# EAGLE board I2CHubLogicLevel (EAGLE 8.4.0)
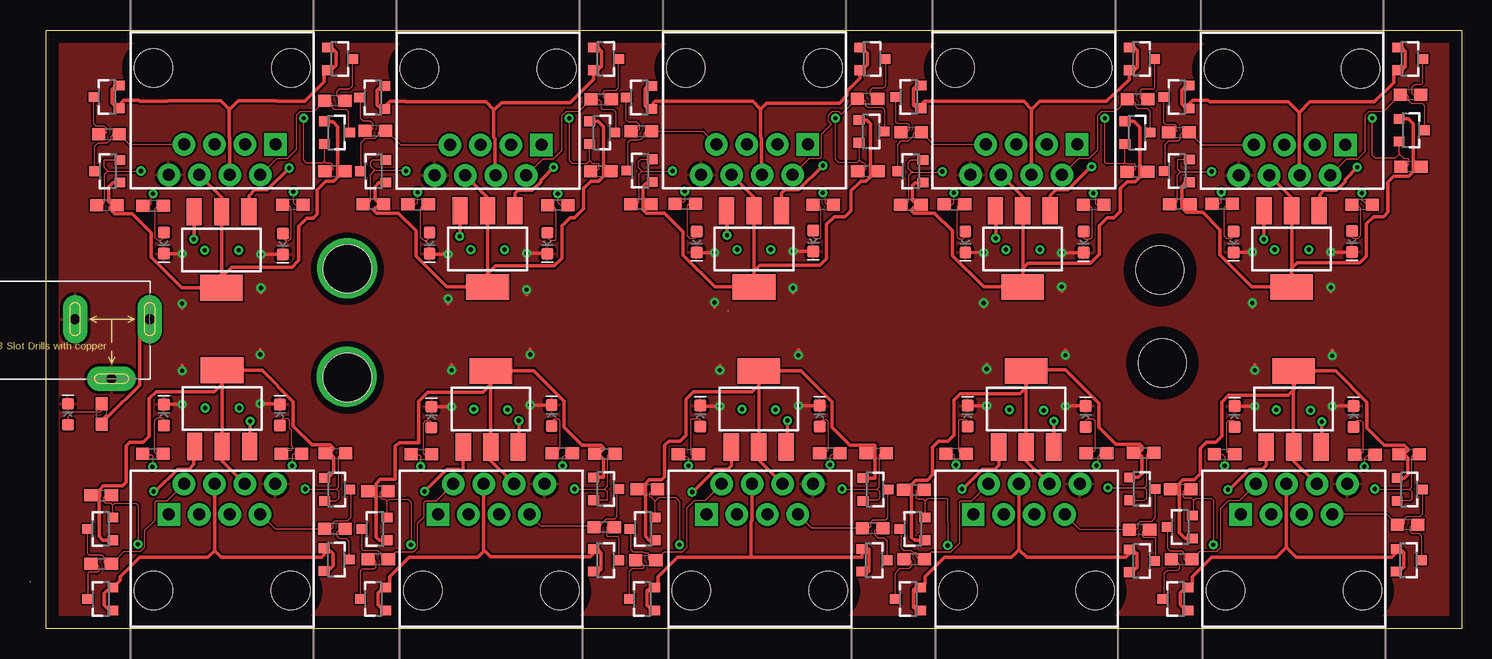
[diagram p2: board, top side]
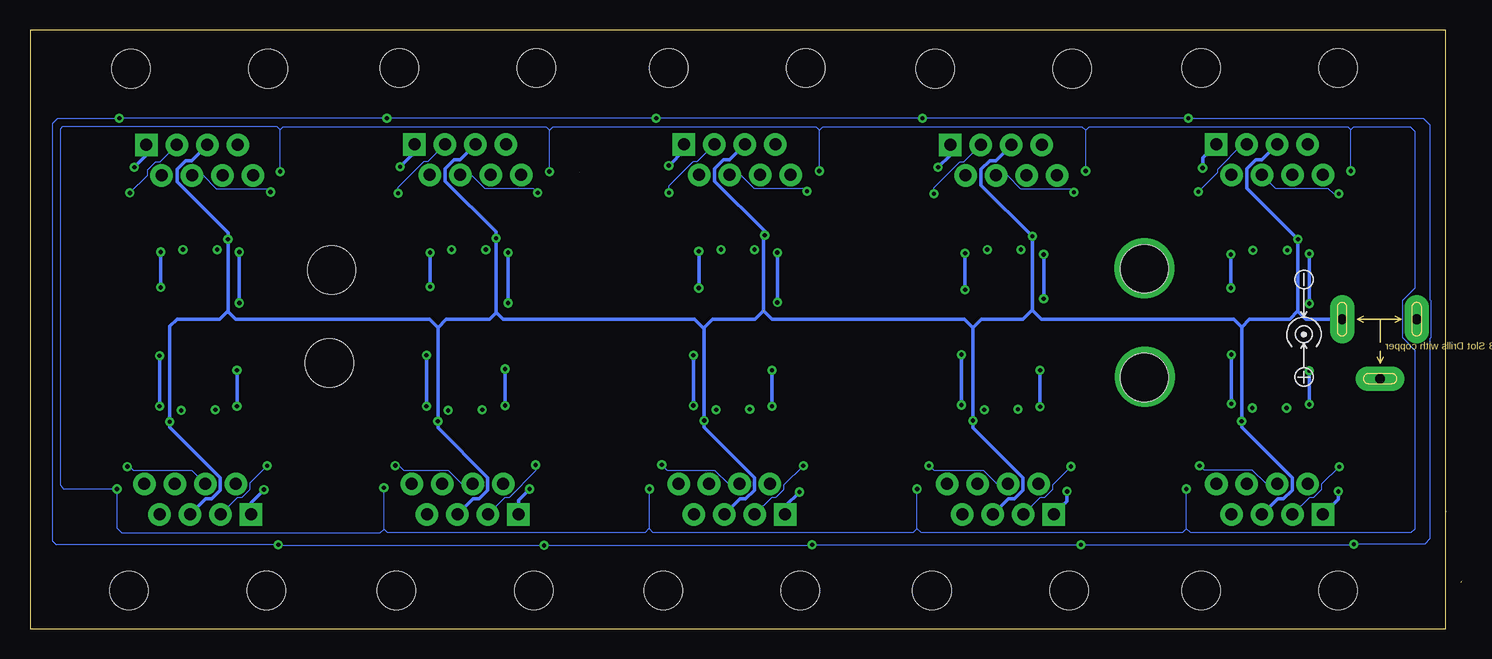
[diagram p3: board, bottom side, seen from below]

Size 119.35 x 49.9 mm. Coordinates in mm from the lower left corner, seen from the top.
Outline: 1.35,9.75 1.35,0 119.35,0 119.35,49.9 1.35,49.9 1.35,9.75
Outline: 1.3,9.75 1.35,9.75
Outline: 0.05,3.9 0,3.95
Copper layers (1*16): Top 0.035mm / dielectric 1.5mm / Bottom 0.035mm
Design rules "default": minimum track width 6mil, minimum drill 0.35mm, track to track 6mil, track to pad 6mil, pad to pad 6mil, via to via 6mil, smd to smd 6mil, copper to edge 40mil, drill to drill 6mil, minimum pad ring 10mil, minimum via ring 8mil, stop-mask expansion 4mil, vias tented up to drill 0mil, thermal gap 10mil
Holes 4 mm at 26.45,30 26.45,20.95 94.2,29.9 94.4,22.15

## Footprints (pad centres in the part's own frame; a part is rotated, then mirrored left to right if it is on the bottom)
LED-0603 = smd 1 x 1: A -0.877,0; C 0.877,0
0603 = smd 1.1 x 1: 1 -0.85,0; 2 0.85,0
SOT-223 = smd 1.27 x 2.286: 1 -2.286,-3.175; 2 0,-3.175; 3 2.286,-3.175 | smd 3.556 x 2.159: TER 0,3.175
DCJ3P-14.2X11.0X9.0MM = drill 0.813 pad 2.032 long: + 3.175,0; -1 -3.048,0; -2 0,-4.953
RJ45-8 = drill 1 pad 1.88 square: 1 -4.445,6.35 | drill 1 pad 1.88: 2 -3.175,8.89; 3 -1.905,6.35; 4 -0.635,8.89; 5 0.635,6.35; 6 1.905,8.89; 7 3.175,6.35; 8 4.445,8.89 | hole 3.2: -5.715,0; 5.715,0
SOT23-3 = smd 0.8 x 0.9: 1 -0.95,-1; 2 0.95,-1; 3 0,1.1

## Placement (x,y rotation side)
3.3VLED0  Yellow  [LED-0603]  11.15,17.83 90 top
3.3VLED1  Yellow  [LED-0603]  33.47,17.63 90 top
3.3VLED2  Yellow  [LED-0603]  55.89,17.73 90 top
3.3VLED3  Yellow  [LED-0603]  78.16,17.73 90 top
3.3VLED4  Yellow  [LED-0603]  100.43,17.68 90 top
3.3VLED5  Yellow  [LED-0603]  110.2,32.28 270 top
3.3VLED6  Yellow  [LED-0603]  87.82,32.23 270 top
3.3VLED7  Yellow  [LED-0603]  65.29,32.33 270 top
3.3VLED8  Yellow  [LED-0603]  43.11,32.13 270 top
3.3VLED9  Yellow  [LED-0603]  21.08,32.08 270 top
3.3VLEDR0  68OHM-0603-1/10W-1%  [0603]  10.25,14.58 0 top
3.3VLEDR1  68OHM-0603-1/10W-1%  [0603]  32.62,14.53 0 top
3.3VLEDR2  68OHM-0603-1/10W-1%  [0603]  54.89,14.53 0 top
3.3VLEDR3  68OHM-0603-1/10W-1%  [0603]  77.2,14.6 0 top
3.3VLEDR4  68OHM-0603-1/10W-1%  [0603]  99.57,14.55 0 top
3.3VLEDR5  68OHM-0603-1/10W-1%  [0603]  111.04,35.35 180 top
3.3VLEDR6  68OHM-0603-1/10W-1%  [0603]  88.66,35.35 180 top
3.3VLEDR7  68OHM-0603-1/10W-1%  [0603]  66.13,35.35 180 top
3.3VLEDR8  68OHM-0603-1/10W-1%  [0603]  44,35.3 180 top
3.3VLEDR9  68OHM-0603-1/10W-1%  [0603]  21.92,35.35 180 top
3.3VREG0  CJT1117-3.3-SOT223  [SOT-223]  16.02,18.36 0 top
3.3VREG1  CJT1117-3.3-SOT223  [SOT-223]  38.41,18.31 0 top
3.3VREG2  CJT1117-3.3-SOT223  [SOT-223]  60.75,18.31 0 top
3.3VREG3  CJT1117-3.3-SOT223  [SOT-223]  83.04,18.31 0 top
3.3VREG4  CJT1117-3.3-SOT223  [SOT-223]  105.33,18.31 0 top
3.3VREG5  CJT1117-3.3-SOT223  [SOT-223]  105.17,31.66 180 top
3.3VREG6  CJT1117-3.3-SOT223  [SOT-223]  82.76,31.66 180 top
3.3VREG7  CJT1117-3.3-SOT223  [SOT-223]  60.35,31.66 180 top
3.3VREG8  CJT1117-3.3-SOT223  [SOT-223]  38.14,31.66 180 top
3.3VREG9  CJT1117-3.3-SOT223  [SOT-223]  15.97,31.58 180 top
5VLED0  RED  [LED-0603]  20.84,17.83 90 top
5VLED1  RED  [LED-0603]  43.48,17.78 90 top
5VLED2  RED  [LED-0603]  65.82,17.73 90 top
5VLED3  RED  [LED-0603]  88.01,17.69 90 top
5VLED4  RED  [LED-0603]  110.35,17.69 90 top
5VLED5  RED  [LED-0603]  100.34,32.24 270 top
5VLED6  RED  [LED-0603]  77.98,32.24 270 top
5VLED7  RED  [LED-0603]  55.57,32.24 270 top
5VLED8  RED  [LED-0603]  33.31,32.14 270 top
5VLED9  RED  [LED-0603]  11.15,32.14 270 top
5VLEDR0  150  [0603]  21.8,14.6 180 top
5VLEDR1  150  [0603]  44.36,14.61 180 top
5VLEDR2  150  [0603]  66.68,14.61 180 top
5VLEDR3  150  [0603]  88.9,14.61 180 top
5VLEDR4  150  [0603]  111.27,14.51 180 top
5VLEDR5  150  [0603]  99.39,35.41 0 top
5VLEDR6  150  [0603]  77.06,35.36 0 top
5VLEDR7  150  [0603]  54.63,35.41 0 top
5VLEDR8  150  [0603]  32.35,35.36 0 top
5VLEDR9  150  [0603]  10.27,35.26 0 top
EXTERNALPOWER  DC-005  [DCJ3P-14.2X11.0X9.0MM]  6.8,25.8 0 top
INOUT0  RJ45  [RJ45-8]  16.01,3.18 0 top
INOUT1  RJ45  [RJ45-8]  38.45,3.18 0 top
INOUT2  RJ45  [RJ45-8]  60.84,3.18 0 top
INOUT3  RJ45  [RJ45-8]  83.08,3.18 0 top
INOUT4  RJ45  [RJ45-8]  105.37,3.18 0 top
INOUT5  RJ45  [RJ45-8]  105.21,46.67 180 top
INOUT6  RJ45  [RJ45-8]  82.85,46.72 180 top
INOUT7  RJ45  [RJ45-8]  60.39,46.72 180 top
INOUT8  RJ45  [RJ45-8]  38.18,46.67 180 top
INOUT9  RJ45  [RJ45-8]  16.02,46.72 180 top
MAINLED  GREEN  [LED-0603]  3.15,17.88 90 top
MAINLEDR  150  [0603]  5.98,17.9 90 top
SC0HVR  10k  [0603]  25.42,8.32 180 top
SC0HVT  220mA/50V/3.5Ω  [SOT23-3]  25.53,5.76 270 top
SC0LVR  10k  [0603]  25.47,14.62 0 top
SC0LVT  220mA/50V/3.5Ω  [SOT23-3]  25.55,11.61 270 top
SC1HVR  10k  [0603]  47.86,8.47 180 top
SC1HVT  220mA/50V/3.5Ω  [SOT23-3]  47.97,5.71 270 top
SC1LVR  10k  [0603]  47.91,14.57 0 top
SC1LVT  220mA/50V/3.5Ω  [SOT23-3]  47.99,11.66 270 top
SC2HVR  10k  [0603]  70.25,8.37 180 top
SC2HVT  220mA/50V/3.5Ω  [SOT23-3]  70.36,5.71 270 top
SC2LVR  10k  [0603]  70.55,14.62 0 top
SC2LVT  220mA/50V/3.5Ω  [SOT23-3]  70.43,11.61 270 top
SC3HVR  10k  [0603]  92.49,8.27 180 top
SC3HVT  220mA/50V/3.5Ω  [SOT23-3]  92.65,5.66 270 top
SC3LVR  10k  [0603]  92.84,14.67 0 top
SC3LVT  220mA/50V/3.5Ω  [SOT23-3]  92.67,11.66 270 top
SC4HVR  10k  [0603]  114.83,8.67 180 top
SC4HVT  220mA/50V/3.5Ω  [SOT23-3]  114.89,5.71 270 top
SC4LVR  10k  [0603]  114.96,14.53 0 top
SC4LVT  220mA/50V/3.5Ω  [SOT23-3]  114.96,11.61 270 top
SC5HVR  10k  [0603]  95.77,41.37 0 top
SC5HVT  220mA/50V/3.5Ω  [SOT23-3]  95.63,44.31 90 top
SC5LVR  10k  [0603]  95.85,35.38 180 top
SC5LVT  220mA/50V/3.5Ω  [SOT23-3]  95.65,38.16 90 top
SC6HVR  10k  [0603]  73.46,41.37 0 top
SC6HVT  220mA/50V/3.5Ω  [SOT23-3]  73.26,44.33 90 top
SC6LVR  10k  [0603]  73.44,35.33 180 top
SC6LVT  220mA/50V/3.5Ω  [SOT23-3]  73.43,38.13 90 top
SC7HVR  10k  [0603]  50.95,41.47 0 top
SC7HVT  220mA/50V/3.5Ω  [SOT23-3]  50.8,44.28 90 top
SC7LVR  10k  [0603]  50.93,35.38 180 top
SC7LVT  220mA/50V/3.5Ω  [SOT23-3]  50.87,38.18 90 top
SC8HVR  10k  [0603]  28.79,41.52 0 top
SC8HVT  220mA/50V/3.5Ω  [SOT23-3]  28.59,44.28 90 top
SC8LVR  10k  [0603]  28.62,35.38 180 top
SC8LVT  220mA/50V/3.5Ω  [SOT23-3]  28.66,38.13 90 top
SC9HVR  10k  [0603]  6.58,41.22 0 top
SC9HVT  220mA/50V/3.5Ω  [SOT23-3]  6.43,44.33 90 top
SC9LVR  10k  [0603]  6.41,35.28 180 top
SC9LVT  220mA/50V/3.5Ω  [SOT23-3]  6.5,38.13 90 top
SD0HVR  10k  [0603]  5.94,5.41 0 top
SD0HVT  220mA/50V/3.5Ω  [SOT23-3]  5.92,2.48 90 top
SD0LVR  10k  [0603]  5.94,11.11 0 top
SD0LVT  220mA/50V/3.5Ω  [SOT23-3]  5.91,8.33 90 top
SD1HVR  10k  [0603]  29.03,5.81 0 top
SD1HVT  220mA/50V/3.5Ω  [SOT23-3]  28.64,2.48 90 top
SD1LVR  10k  [0603]  29.01,11.47 0 top
SD1LVT  220mA/50V/3.5Ω  [SOT23-3]  28.78,8.33 90 top
SD2HVR  10k  [0603]  51.32,5.71 0 top
SD2HVT  220mA/50V/3.5Ω  [SOT23-3]  51.05,2.48 90 top
SD2LVR  10k  [0603]  51.45,11.62 0 top
SD2LVT  220mA/50V/3.5Ω  [SOT23-3]  51.12,8.33 90 top
SD3HVR  10k  [0603]  73.71,5.81 0 top
SD3HVT  220mA/50V/3.5Ω  [SOT23-3]  73.24,2.48 90 top
SD3LVR  10k  [0603]  73.69,11.57 0 top
SD3LVT  220mA/50V/3.5Ω  [SOT23-3]  73.61,8.33 90 top
SD4HVR  10k  [0603]  96,5.81 0 top
SD4HVT  220mA/50V/3.5Ω  [SOT23-3]  95.53,2.48 90 top
SD4LVR  10k  [0603]  95.93,11.62 0 top
SD4LVT  220mA/50V/3.5Ω  [SOT23-3]  95.9,8.48 90 top
SD5HVR  10k  [0603]  115.09,44.51 180 top
SD5HVT  220mA/50V/3.5Ω  [SOT23-3]  115.01,47.5 270 top
SD5LVR  10k  [0603]  115.12,38.52 180 top
SD5LVT  220mA/50V/3.5Ω  [SOT23-3]  115.13,41.55 270 top
SD6HVR  10k  [0603]  92.33,44.11 180 top
SD6HVT  220mA/50V/3.5Ω  [SOT23-3]  92.65,47.5 270 top
SD6LVR  10k  [0603]  92.31,38.07 180 top
SD6LVT  220mA/50V/3.5Ω  [SOT23-3]  92.27,41.35 270 top
SD7HVR  10k  [0603]  69.82,44.16 180 top
SD7HVT  220mA/50V/3.5Ω  [SOT23-3]  70.19,47.5 270 top
SD7LVR  10k  [0603]  69.85,38.12 180 top
SD7LVT  220mA/50V/3.5Ω  [SOT23-3]  70.11,41.45 270 top
SD8HVR  10k  [0603]  47.61,44.11 180 top
SD8HVT  220mA/50V/3.5Ω  [SOT23-3]  47.98,47.5 270 top
SD8LVR  10k  [0603]  47.59,38.12 180 top
SD8LVT  220mA/50V/3.5Ω  [SOT23-3]  47.65,41.35 270 top
SD9HVR  10k  [0603]  25.4,44.01 180 top
SD9HVT  220mA/50V/3.5Ω  [SOT23-3]  25.82,47.5 270 top
SD9LVR  10k  [0603]  25.43,38.12 180 top
SD9LVT  220mA/50V/3.5Ω  [SOT23-3]  25.54,41.35 270 top

## Tracks (layer width: path | path; a pad name or v marks a point on that pad's centre or on a via)
3.3CC0  (via drill 0.35)
  Top 0.102: 3.3VLEDR0.1 9.48,14.49 10.15,14.49 10.21,14.43 v10.21,13.52
  Bottom 0.102: v10.21,13.52 11.69,12.04 11.69,11.6 12.36,10.93 12.71,10.93 INOUT0.3
3.3CC1  (via drill 0.35)
  Top 0.102: 3.3VLEDR1.1 31.8,14.5 32.45,14.5 32.5,14.45 32.58,14.37 v32.58,13.53
  Bottom 0.102: v32.58,13.53 34.13,11.97 34.13,11.6 34.8,10.93 35.15,10.93 INOUT1.3
3.3CC2  (via drill 0.35)
  Top 0.102: 3.3VLEDR2.1 54.17,14.4 54.7,14.4 54.88,14.21 v54.88,13.59
  Bottom 0.102: v54.88,13.59 56.52,11.95 56.52,11.6 57.19,10.93 57.54,10.93 INOUT2.3
3.3CC3  (via drill 0.35)
  Top 0.102: v77.2,13.65 77.05,13.8 77.05,14.45 76.9,14.6 3.3VLEDR3.1
  Bottom 0.102: INOUT3.3 79.78,10.93 79.43,10.93 77.2,13.16 v77.2,13.65
3.3CC4  (via drill 0.35)
  Top 0.102: 3.3VLEDR4.1 99.4,14.55 99.5,14.45 99.58,14.36 v99.58,13.59
  Bottom 0.102: v99.58,13.59 101.05,12.12 101.05,11.6 101.72,10.93 102.07,10.93 INOUT4.3
3.3CC5  (via drill 0.35)
  Top 0.102: 3.3VLEDR5.1 111.74,35.5 111.25,35.5 111.02,35.73 v111.02,36.32
  Bottom 0.102: v111.02,36.32 109.53,37.81 109.53,38.25 108.86,38.92 108.51,38.92 INOUT5.3
3.3CC6  (via drill 0.35)
  Top 0.102: 3.3VLEDR6.1 88.9,35.35 88.85,35.4 88.85,36.11 v88.66,36.3
  Bottom 0.102: INOUT6.3 86.15,38.97 86.5,38.97 88.66,36.82 v88.66,36.3
3.3CC7  (via drill 0.35)
  Top 0.102: 3.3VLEDR7.1 66.95,35.38 66.45,35.38 66.27,35.55 66.27,36.16 v66.09,36.34
  Bottom 0.102: INOUT7.3 63.69,38.97 64.04,38.97 66.09,36.92 v66.09,36.34
3.3CC8  (via drill 0.35)
  Top 0.102: 3.3VLEDR8.1 44.21,35.3 44,35.51 v44,36.25
  Bottom 0.102: INOUT8.3 41.48,38.92 41.83,38.92 44,36.75 v44,36.25
3.3CC9  (via drill 0.35)
  Top 0.102: 3.3VLEDR9.1 22.1,35.35 22,35.45 21.96,35.5 v21.96,36.41
  Bottom 0.102: v21.96,36.41 20.34,38.03 20.34,38.3 18.27,40.37 INOUT9.3
3.3LED0
  Top 0.102: 3.3VLED0.A 11.15,17.45 11.05,17.55 10.55,17.55 10.4,17.4 10.4,14.7 10.52,14.58 3.3VLEDR0.2
3.3LED1
  Top 0.102: 3.3VLED1.A 33.45,16.77 33.45,17.25 33.35,17.35 32.95,17.35 32.75,17.15 32.75,14.65 32.87,14.53 3.3VLEDR1.2
3.3LED2
  Top 0.102: 3.3VLED2.A 55.9,16.86 55.9,17.45 55.05,17.45 55.07,17.43 55.07,14.53 3.3VLEDR2.2
3.3LED3
  Top 0.102: 3.3VLEDR3.2 77.65,14.6 77.4,14.85 77.4,17.35 77.5,17.45 78,17.45 78.16,17.29 3.3VLED3.A
3.3LED4
  Top 0.102: 3.3VLED4.A 100.45,16.82 100.45,17.25 100.3,17.4 99.95,17.4 99.75,17.2 99.75,14.75 99.95,14.55 3.3VLEDR4.2
3.3LED5
  Top 0.102: 3.3VLEDR5.2 110.65,35.35 110.9,35.1 110.9,32.75 110.65,32.5 110.35,32.5 110.2,32.65 3.3VLED5.A
3.3LED6
  Top 0.102: 3.3VLEDR6.2 88.25,35.35 88.5,35.1 88.5,32.6 88.35,32.45 87.95,32.45 87.82,32.58 3.3VLED6.A
3.3LED7
  Top 0.102: 3.3VLED7.A 65.3,33.2 65.3,32.65 65.45,32.5 65.8,32.5 65.95,32.65 65.95,35.15 65.75,35.35 3.3VLEDR7.2
3.3LED8
  Top 0.102: 3.3VLED8.A 43.15,32.97 43.15,32.6 43.4,32.35 43.75,32.35 43.85,32.45 43.85,34.95 43.55,35.25 43.55,35.3 3.3VLEDR8.2
3.3LED9
  Top 0.102: 3.3VLEDR9.2 21.5,35.35 21.75,35.1 21.75,32.55 21.55,32.35 21.3,32.35 21.08,32.57 3.3VLED9.A
3.3V0
  Top 0.305: INOUT0.6 16.02,13.96 3.3VREG0.2 16,15.21 16,20.4 | 25.05,14.59 SC0LVR.1 | SC0LVT.1 24.85,12.56 24.85,12.57 25.33,13.05 25.33,14.35 25.09,14.59 25.05,14.59 | SD0LVR.1 5.09,11 5.75,11 | 5.75,11 5.75,7.7 6.07,7.38 SD0LVT.1 | 5.75,11 5.79,11.04 5.79,11.6 6.11,11.91 7.71,11.91 8,12.2 8,15.25 8.3,15.55 9.45,15.55 9.95,16.05 9.95,19.2 10.5,19.75 15.35,19.75 16,20.4 | 16,20.4 16,21.54 3.3VREG0.TER 19.36,21.54 21.96,18.93 21.96,16.89 23.5,15.35 25,15.35 25.25,15.1 25.25,14.95 25.05,14.75 25.05,14.59
3.3V1
  Top 0.305: 38.41,15 3.3VREG1.2 | 38.41,15 38.41,14.02 INOUT1.6 | SC1LVR.1 47.08,14.55 47.4,14.55 | 3.3VREG1.TER 42,21.48 44.51,18.98 44.51,16.8 46,15.3 47.6,15.3 47.8,15.1 47.8,14.95 47.4,14.55 | SC1LVT.1 47.8,12.61 47.8,14.15 47.4,14.55 | 28.84,11.47 SD1LVR.1 | 28.84,11.47 28.84,7.65 29.11,7.38 SD1LVT.1 | 3.3VREG1.TER 38.41,20.36 37.75,19.7 33.15,19.7 32.39,18.94 32.39,15.5 30.75,15.5 30.45,15.2 30.45,12.45 29.2,12.45 28.84,12.09 28.84,11.47 | 3.3VREG1.TER 38.41,15
3.3V2
  Top 0.305: INOUT2.6 60.75,14.06 3.3VREG2.2 3.3VREG2.TER | SC2LVR.1 70.42,14.62 | 70.42,14.62 70.44,14.64 70.44,15.29 70.45,15.3 68.35,15.3 66.86,16.79 66.86,18.91 64.28,21.48 3.3VREG2.TER | 70.42,14.62 70.42,12.56 SC2LVT.1 | SD2LVR.1 51.27,11.62 | 51.27,11.62 51.29,11.6 51.29,7.7 51.61,7.38 SD2LVT.1 | 51.27,11.62 51.29,11.64 51.29,11.75 51.3,11.75 51.3,12.1 51.62,12.43 52.65,12.43 52.9,12.68 52.9,15.3 53.25,15.65 54.2,15.65 54.69,16.14 54.69,19.14 55.3,19.75 60.2,19.75 60.75,20.3 3.3VREG2.TER
3.3V3
  Top 0.305: INOUT3.6 83.04,14.02 3.3VREG3.2 3.3VREG3.TER | 91.91,14.7 SC3LVR.1 | 92.7,14.9 92.7,15.2 92.5,15.4 90.5,15.4 89.11,16.79 89.11,18.82 86.32,21.6 82.5,21.6 82.61,21.48 3.3VREG3.TER | SC3LVT.1 92.4,12.61 92.7,12.91 92.7,14.4 | 73.49,11.57 SD3LVR.1 | 73.49,11.57 73.49,7.65 73.76,7.38 SD3LVT.1 | 3.3VREG3.TER 83.05,20.15 82.5,19.6 77.55,19.6 77,19.05 77,16.15 76.5,15.65 75.75,15.65 75.25,15.15 75.25,12.82 74.8,12.38 73.86,12.38 73.49,12.01 73.49,11.57 | 92.13,14.81 SC3LVR.1 | 92.13,14.81 92.22,14.9 92.7,14.9 | SC3LVR.1 92.26,14.4 92.7,14.4 | 92.4,14.7 92.7,14.4 | 92.4,14.7 92.28,14.81 92.13,14.81 | 92.7,14.9 92.5,14.7 92.4,14.7
3.3V4
  Top 0.305: INOUT4.6 105.33,14.02 3.3VREG4.2 3.3VREG4.TER 105.4,21.48 | 114.55,14.55 114.13,14.55 SC4LVR.1 114.53,14.53 114.85,14.85 | 105.4,21.48 108.86,21.48 111.46,18.89 111.46,16.74 112.9,15.3 114.55,15.3 114.85,15 114.85,14.85 | SC4LVT.1 114.55,12.56 114.84,12.85 114.85,12.85 114.85,14.25 114.55,14.55 | SD4LVR.1 95.75,11.62 | 95.75,11.62 95.75,11.65 95.79,11.61 95.79,10.8 95.8,10.8 95.8,8 96.25,7.55 96.9,7.55 SD4LVT.1 | 95.75,11.62 95.79,11.66 95.79,12.12 96.1,12.43 97.05,12.43 97.55,12.93 97.55,15.05 98.05,15.55 98.85,15.55 99.35,16.05 99.35,18.9 99.9,19.45 104.9,19.45 105.4,19.95 105.4,21.48 | 114.85,14.85 114.55,14.55
3.3V5
  Top 0.305: INOUT5.6 105.17,35.91 3.3VREG5.2 3.3VREG5.TER 105.1,28.48 | SC5LVR.1 96.68,35.4 96,35.4 | 96,35.4 96,35.1 96.4,34.7 97.77,34.7 99.19,33.27 99.19,31.16 101.88,28.48 105.1,28.48 | 96,35.4 96,36.9 96.3,37.2 96.3,37.21 SC5LVT.1 | SD5LVR.1 115.84,38.65 115.31,38.65 | 115.31,38.65 115.31,42.1 114.91,42.5 SD5LVT.1 | 105.1,28.48 105.15,28.48 105.15,30 105.65,30.5 110.85,30.5 111.4,31.05 111.4,33.75 112,34.35 112.85,34.35 113.2,34.7 113.2,37.2 113.7,37.7 113.7,37.72 114.95,37.72 115.31,38.08 115.31,38.65
3.3V6
  Top 0.305: INOUT6.6 82.76,36.02 3.3VREG6.2 3.3VREG6.TER | 73.95,35.33 SC6LVR.1 73.88,35.33 73.45,34.9 | 3.3VREG6.TER 79.52,28.48 76.89,31.11 76.89,33.16 75.4,34.65 73.7,34.65 73.45,34.9 | SD6LVR.1 93.14,38.05 92.51,38.05 | 92.51,38.05 92.51,41.8 92.01,42.3 SD6LVT.1 | 3.3VREG6.TER 82.75,30 83.2,30.45 88.4,30.45 89.15,31.2 89.15,33.6 89.8,34.25 90.35,34.25 90.9,34.8 90.9,36.7 91.46,37.27 92.14,37.27 92.51,37.63 92.51,38.05 | 73.95,35.33 73.58,35.7 73.58,36.95 73.81,37.18 SC6LVT.1 | 73.45,34.9 73.52,34.9 73.95,35.33
3.3V7
  Top 0.305: INOUT7.6 60.35,35.97 3.3VREG7.2 3.3VREG7.TER | SC7LVR.1 51.75,35.35 51.3,35.35 | 51.3,35.35 51.1,35.35 | 51.1,35.35 51.1,34.9 51.15,34.9 51.4,34.65 52.9,34.65 54.44,33.11 54.44,31.14 57.11,28.48 3.3VREG7.TER | SD7LVR.1 70.7,38.1 70.05,38.1 | 70.05,38.1 70.05,42.1 69.75,42.4 SD7LVT.1 | 51.1,35.35 51.1,35.9 | 51.1,35.9 51.1,36.9 51.35,37.15 51.87,37.15 SC7LVT.1 | 51.1,35.9 51.1,35.55 51.3,35.35 | 3.3VREG7.TER 60.35,29.8 60.85,30.3 65.85,30.3 66.4,30.85 66.4,33.7 67.05,34.35 67.95,34.35 68.45,34.85 68.45,36.5 69.27,37.31 69.68,37.31 70.05,37.69 70.05,38.1
3.3V8
  Top 0.305: 38.14,34.95 3.3VREG8.2 | 38.14,34.95 38.14,35.91 INOUT8.6 | SC8LVR.1 29.45,35.4 29.05,35.4 | 3.3VREG8.TER 34.75,28.48 32.19,31.04 32.19,33.16 30.7,34.65 28.9,34.65 28.65,34.9 28.65,34.95 29.05,35.3 29.05,35.4 | SD8LVR.1 47.81,38.12 | 47.81,38.12 47.81,41.85 47.36,42.3 SD8LVT.1 | 47.81,38.12 47.81,38.05 47.8,38.05 47.8,37.7 47.42,37.31 46.77,37.31 46.15,36.7 46.15,35 45.4,34.25 45,34.25 44.35,33.6 44.35,30.9 43.7,30.25 38.8,30.25 38.15,29.6 3.3VREG8.TER | SC8LVT.1 29.08,37.18 28.75,36.85 28.75,35.8 29.05,35.5 29.05,35.4 | 3.3VREG8.TER 38.14,34.95
3.3V9
  Top 0.305: INOUT9.6 15.97,35.98 3.3VREG9.2 3.3VREG9.TER | SC9LVR.1 7.24,35.3 6.95,35.3 | 6.85,35.3 6.95,35.3 | 3.3VREG9.TER 12.66,28.41 10.09,30.98 10.09,33.01 8.5,34.6 7.05,34.6 6.65,35 6.65,35.1 6.85,35.3 | SD9LVR.1 25.65,38.12 | SD9LVT.1 24.54,42.25 25.25,42.25 25.65,41.85 25.65,38.12 | 3.3VREG9.TER 15.95,28.41 15.95,29.3 16.8,30.15 21.85,30.15 22.4,30.7 22.4,33.55 23.05,34.2 23.6,34.2 23.95,34.55 23.95,36.6 24.65,37.3 25.3,37.3 25.65,37.65 25.65,38.12 | 6.95,35 6.95,35.3 | 6.85,35.3 6.55,35.6 6.55,36.85 6.88,37.18 SC9LVT.1
5V  (via drill 0.35)  (1 unrouted)
  Top 0.305: v13.65,32.45 13.68,32.45 3.3VREG9.3 | v18.35,17.3 18.35,15.19 3.3VREG0.3 | v35.8,32.7 35.85,32.7 3.3VREG8.3 | v40.75,17.35 40.75,15.13 3.3VREG1.3 | v58.1,32.8 58.1,34.84 3.3VREG7.3 | v63.15,17.35 63.15,15.13 3.3VREG2.3 | v80.5,32.55 80.5,34.84 3.3VREG6.3 | v85.35,17.3 85.35,15.13 3.3VREG3.3 | v102.85,32.45 102.85,34.84 3.3VREG5.3 | v107.7,17.25 107.7,15.13 3.3VREG4.3 | MAINLEDR.1 6,17.07 6,17.4 6.29,17.69 6.53,17.69 9.14,20.3 9.14,24.96 EXTERNALPOWER.+
  Bottom 0.305: EXTERNALPOWER.+ 13,25.8 13.65,26.45 13.65,26.5 | 13.65,26.5 v13.65,32.45 17.9,36.7 17.9,38.35 17.17,39.08 16.68,39.08 INOUT9.5 | 18.35,25.15 v18.35,17.3 18.35,16.8 14.13,12.59 14.13,11.55 14.86,10.82 15.35,10.82 INOUT0.5 | 35.8,26.55 v35.8,32.7 40.06,36.96 40.06,38.3 39.33,39.02 38.84,39.02 INOUT8.5 | 40.75,25.1 40.75,25.15 40.8,25.15 41.45,25.8 57.5,25.8 58.2,26.5 58.9,25.8 62.45,25.8 63.15,25.1 63.15,25.05 | 40.75,25.1 v40.75,17.35 40.75,16.77 36.57,12.59 36.57,11.55 37.3,10.82 37.79,10.82 INOUT1.5 | 58.2,26.45 58.2,32.8 v58.1,32.8 58.1,33.15 62.27,37.31 62.27,38.35 61.54,39.08 61.05,39.08 INOUT7.5 | 63.15,25.05 v63.15,17.35 63.15,16.77 58.96,12.59 58.96,11.55 59.69,10.82 60.18,10.82 INOUT2.5 | 80.5,26.4 v80.5,32.55 80.5,33.09 84.73,37.31 84.73,38.35 84,39.08 83.51,39.08 INOUT6.5 | 85.35,25.1 v85.35,17.3 85.35,16.73 81.2,12.59 81.2,11.55 81.93,10.82 82.42,10.82 INOUT3.5 | 102.85,26.4 v102.85,32.45 102.85,33.02 107.09,37.26 107.09,38.3 106.36,39.02 105.87,39.02 INOUT5.5 | INOUT4.5 104.71,10.82 104.22,10.82 103.49,11.55 103.49,12.59 107.7,16.8 v107.7,17.25 107.7,25.2 107.1,25.8 103.55,25.8 102.95,26.4 102.85,26.4 | 13.65,26.5 14.35,25.8 17.7,25.8 18.35,25.15 | 18.35,25.15 19,25.8 35.05,25.8 35.8,26.55 | 35.8,26.55 35.85,26.55 36.6,25.8 40.05,25.8 40.75,25.1 | 63.15,25.05 63.2,25.05 63.95,25.8 79.9,25.8 80.5,26.4 | 80.5,26.4 80.5,26.35 81.05,25.8 84.65,25.8 85.35,25.1 | 85.35,25.1 86.05,25.8 102.2,25.8 102.8,26.4 102.85,26.4
5VCC0  (via drill 0.35)
  Top 0.102: v21.85,13.6 21.85,14.45 22,14.6 5VLEDR0.1
  Top 0.305: 15.38,6.5 INOUT0.4 | SD0HVT.1 6.62,1.53 6.2,1.95 6.2,2.95 6.68,3.43 SD0HVT.2 7.53,4.04 7.53,4.33 9.15,5.95 14.82,5.95 15.38,6.5 | 15.38,6.5 15.93,5.95 24.3,5.95 24.53,6.18 SC0HVT.1 24.79,6.71 25.25,6.25 25.25,5.25 24.81,4.81 SC0HVT.2
  Bottom 0.102: INOUT0.4 16.3,12.07 17.44,13.21 21.46,13.21 v21.85,13.6
5VCC1  (via drill 0.35)
  Top 0.102: 5VLEDR1.1 45.12,14.53 44.62,14.53 44.4,14.3 v44.4,13.6
  Top 0.305: SC1HVT.2 47.4,4.75 47.6,4.95 47.6,6.35 47.25,6.7 46.97,6.7 SC1HVT.1 46.97,6.3 46.67,6 38.4,6 37.8,6.6 | INOUT1.4 37.8,12.07 37.8,7.15 37.8,6.6 | SD1HVT.1 29.47,1.53 29,2 29,3 29.35,3.35 29.35,3.43 SD1HVT.2 29.97,3.76 29.97,4.33 31.59,5.95 37.3,5.95 37.8,6.45 37.8,6.6
  Bottom 0.102: v44.4,13.6 44.01,13.21 39.88,13.21 38.74,12.07 INOUT1.4
5VCC2  (via drill 0.35)
  Top 0.102: 5VLEDR2.1 67.44,14.53 66.82,14.53 66.68,14.38 v66.68,13.66
  Top 0.305: SC2HVT.2 69.9,4.76 69.9,4.8 69.95,4.8 69.95,6.65 69.31,6.65 SC2HVT.1 69.36,5.95 59.95,5.95 | 59.95,5.95 53.98,5.95 52.36,4.33 52.36,3.74 SD2HVT.2 51.75,3.43 51.52,3.2 51.45,3.2 51.45,1.95 51.87,1.53 SD2HVT.1 | 59.95,5.95 60.05,5.95 60.1,6 60.1,8.94 60.18,9.01 60.18,12.04 INOUT2.4
  Bottom 0.102: v66.68,13.66 66.23,13.21 62.27,13.21 61.13,12.07 INOUT2.4
5VCC3  (via drill 0.35)
  Top 0.102: v88.89,13.61 89.05,13.76 89.05,14.4 89.26,14.61 5VLEDR3.1
  Top 0.305: SD3HVT.1 74.24,1.5 74,1.5 73.7,1.8 73.65,1.8 73.65,3.25 73.83,3.43 SD3HVT.2 74.6,3.79 74.6,4.33 76.22,5.95 81.8,5.95 82.45,6.6 | SC3HVT.2 91.65,4.75 91.9,4.75 92.25,5.1 92.25,6.3 92.21,6.3 91.9,6.61 SC3HVT.1 91.65,6.25 91.35,5.95 83.1,5.95 82.45,6.6 | 82.45,6.6 INOUT3.4
  Bottom 0.102: INOUT3.4 83.37,12.07 84.51,13.21 88.2,13.21 88.59,13.61 v88.89,13.61
5VCC4  (via drill 0.35)
  Top 0.102: 5VLEDR4.1 112.08,14.47 111.52,14.47 111.23,14.18 v111.23,13.52
  Top 0.305: SD4HVT.1 96.53,1.5 96.25,1.5 96.25,1.65 95.9,2 95.9,3 96.3,3.4 96.3,3.43 SD4HVT.2 96.89,3.79 96.89,4.33 98.51,5.95 103.9,5.95 104.73,6.78 | SC4HVT.2 113.89,4.8 114.15,4.8 114.5,5.15 114.5,6.36 114.2,6.66 SC4HVT.1 113.9,6.35 113.5,5.95 105.57,5.95 104.73,6.78 | INOUT4.4 104.73,6.78
  Bottom 0.102: v111.23,13.52 111.06,13.52 110.75,13.21 105.88,13.21 INOUT4.4
5VCC5  (via drill 0.35)
  Top 0.102: 5VLEDR5.1 99.16,35.41 99.3,35.55 v99.3,36.4
  Top 0.305: SC5HVT.2 96.63,45.2 96.3,45.2 96,44.9 96,43.71 96.35,43.36 SC5HVT.1 96.65,43.36 96.65,43.75 96.95,44.05 98.2,44.05 98.35,43.9 104.9,43.9 105.8,43 | 105.8,43 105.8,40.85 105.82,40.84 105.82,37.8 INOUT5.4 | 105.8,43 106.7,43.9 112.07,43.9 113.69,45.52 113.69,46.23 SD5HVT.2 114.35,46.55 114.65,46.85 114.65,48.15 114.35,48.45 SD5HVT.1
  Bottom 0.102: v99.3,36.4 99.54,36.64 103.78,36.64 104.92,37.78 INOUT5.4
5VCC6  (via drill 0.35)
  Top 0.102: 5VLEDR6.1 76.85,35.35 77.02,35.52 v77.02,36.33
  Top 0.305: SC6HVT.2 74.26,45.2 73.85,45.2 73.65,45 73.65,43.65 73.92,43.38 73.98,43.38 | 83.46,37.85 INOUT6.4 83.48,43.23 | 83.48,43.23 83.48,43.3 82.83,43.95 74.55,43.95 73.98,43.38 | 83.48,43.23 84.2,43.95 89.74,43.95 91.65,45.76 SD6HVT.2 92.05,46.55 92.3,46.8 92.3,48.2 92.05,48.45 SD6HVT.1 | 73.98,43.38 SC6HVT.1
  Bottom 0.102: v77.02,36.33 77.39,36.69 81.42,36.69 82.56,37.83 INOUT6.4
5VCC7  (via drill 0.35)
  Top 0.102: 5VLEDR7.1 53.92,35.55 54.45,35.55 54.59,35.69 v54.59,36.47
  Top 0.305: SC7HVT.2 51.85,45.25 51.5,45.25 51.25,45 51.25,43.6 51.5,43.35 51.56,43.35 SC7HVT.1 51.8,43.65 52.1,43.95 60.25,43.95 60.9,43.3 | SD7HVT.1 69.19,48.4 69.45,48.4 69.45,48.3 69.8,47.95 69.8,47 69.45,46.65 69.45,46.55 SD7HVT.2 69.19,45.86 68.11,44.79 68.11,44.45 67.46,43.8 61.4,43.8 60.9,43.3 | 60.9,43.3 60.9,40.98 61,40.89 61,37.85 INOUT7.4
  Bottom 0.102: v54.59,36.47 54.81,36.69 58.96,36.69 60.1,37.83 INOUT7.4
5VCC8  (via drill 0.35)
  Top 0.102: 5VLEDR8.1 32.16,35.36 32.32,35.52 v32.32,36.38
  Top 0.305: SC8HVT.2 29.59,45.15 29.2,45.15 28.95,44.9 28.95,43.63 29.25,43.33 SC8HVT.1 29.6,43.55 30,43.95 31.27,43.95 31.32,43.9 38,43.9 | 38.65,43.2 38.65,40.98 38.79,40.84 38.79,37.8 INOUT8.4 | SD8HVT.1 47.35,48.45 47.65,48.15 47.65,46.9 47.3,46.55 SD8HVT.2 46.98,45.81 45.02,43.85 39.3,43.85 38.65,43.2 | 38,43.9 38.55,43.35 | 38.65,43.2 38.65,43.25 38,43.9
  Bottom 0.102: v32.32,36.38 32.58,36.64 36.75,36.64 37.89,37.78 INOUT8.4
5VCC9  (via drill 0.35)
  Top 0.102: v10.25,36.24 10.05,36.04 10.05,35.4 9.91,35.26 5VLEDR9.1
  Top 0.305: SC9HVT.2 7.15,45.28 6.85,44.98 6.85,43.8 7.25,43.4 7.43,43.4 | SD9HVT.1 25.1,48.45 25.5,48.05 25.5,46.95 25.1,46.55 SD9HVT.2 24.5,46.23 24.5,45.57 22.88,43.95 20.59,43.95 20.54,44 17.35,44 16.6,43.25 | 16.6,43.25 16.6,43.3 15.9,44 11.5,44 11.45,43.95 9.16,43.95 9.06,44.05 7.8,44.05 7.43,43.68 7.43,43.4 | 16.6,43.25 16.6,40.91 16.63,40.89 16.63,37.85 INOUT9.4 | SC9HVT.1 7.43,43.4
  Bottom 0.102: INOUT9.4 15.51,36.69 11.1,36.69 10.66,36.24 v10.25,36.24
5VLED0
  Top 0.102: 5VLED0.A 20.84,17.35 20.86,17.35 21.05,17.54 21.46,17.54 21.6,17.4 21.6,16.75 21.75,16.6 21.75,15.29 21.9,15.18 21.9,15.05 21.75,14.9 21.25,14.9 5VLEDR0.2
5VLED1
  Top 0.102: 5VLED1.A 43.5,16.92 43.5,17.3 43.7,17.5 44.05,17.5 44.15,17.4 44.15,14.95 43.95,14.75 43.95,14.61 5VLEDR1.2
5VLED2
  Top 0.102: 5VLED2.A 65.8,16.87 65.8,17.15 65.85,17.15 66.15,17.45 66.35,17.45 66.5,17.3 66.5,14.9 66.2,14.6 5VLEDR2.2
5VLED3
  Top 0.102: 5VLED3.A 88.01,17.36 88.15,17.5 88.6,17.5 88.75,17.35 88.75,14.9 88.5,14.65 88.09,14.65 5VLEDR3.2
5VLED4
  Top 0.102: 5VLED4.A 110.35,17.15 110.6,17.4 110.9,17.4 111.1,17.2 111.1,14.7 110.9,14.5 5VLEDR4.2
5VLED5
  Top 0.102: 5VLED5.A 100.35,33.11 100.35,32.7 100.15,32.5 99.75,32.5 99.55,32.7 99.55,35.15 99.75,35.35 100.18,35.35 5VLEDR5.2
5VLED6
  Top 0.102: 5VLED6.A 78,33.1 78,32.7 77.8,32.5 77.45,32.5 77.3,32.65 77.3,35.2 77.46,35.36 5VLEDR6.2
5VLED7
  Top 0.102: 5VLED7.A 55.5,33.05 55.5,32.6 55.4,32.5 55,32.5 54.8,32.7 54.8,35.31 54.9,35.41 5VLEDR7.2
5VLED8
  Top 0.102: 5VLED8.A 33.31,32.61 33.05,32.35 32.85,32.35 32.55,32.65 32.55,35.1 32.81,35.36 5VLEDR8.2
5VLED9
  Top 0.102: 5VLEDR9.2 10.65,35.26 10.65,35.25 10.45,35.05 10.45,32.6 10.65,32.4 10.95,32.4 11.15,32.6 5VLED9.A
GND  (via drill 0.35)
  Top 0.305: 5VLED0.C 20.8,18.75 v19.2,18.75 | 3.3VLED1.C v35.15,18.5 | v35.15,21.55 35.15,22 | 5VLED1.C v41.7,18.65 | v41.7,22.85 41.7,23.3 | 3.3VLED2.C 55.95,18.55 v57.5,18.55 | v57.5,21.55 57.5,21.95 | 5VLED2.C 64.44,18.61 v64.05,18.6 | v64.05,22.8 64.05,23.25 | 3.3VLED3.C v79.75,18.6 | v79.75,21.65 79.75,22.05 | 5VLED3.C 86.88,18.57 v86.3,18.55 | v86.3,22.8 86.3,23.2 | 3.3VLED4.C 101.59,18.56 v102.1,18.55 | v102.1,21.55 102.1,22 | 5VLED4.C 109.18,18.57 v108.55,18.55 | v108.55,22.75 108.55,23.2 | 3.3VLED5.C v108.45,31.4 | v108.45,28.45 108.45,28.1 | 5VLED5.C 100.38,31.4 v101.9,31.4 | v101.9,27.15 101.9,26.8 | 3.3VLED6.C 86.5,31.35 v86,31.35 | v86,28.5 86,28.15 | 5VLED6.C v79.5,31.35 | v79.5,27.15 79.5,26.8 | 3.3VLED7.C 63.95,31.45 v63.6,31.45 | v63.6,28.4 63.6,28 | 5VLED7.C 55.58,31.35 v57.05,31.35 | v57.05,27.2 57.05,26.8 | 3.3VLED8.C 43.06,31.3 v41.4,31.3 | v41.4,28.25 41.4,27.85 | 5VLED8.C 33.37,31.2 v34.85,31.2 | v34.85,27.5 34.85,27.1 | 3.3VLED9.C v19.25,31.2 | v19.25,28.4 19.25,28 | 5VLED9.C 12.51,31.26 v12.7,31.25 | v12.7,27.1 12.7,26.7 | v12.7,21.5 12.7,21.95 | 19.2,23.25 v19.2,22.85 | 3.3VLED0.C 12.21,18.71 v12.7,18.7
  Bottom 0.305: v12.7,18.7 v12.7,21.5 | v19.2,18.75 v19.2,22.85 | v35.15,18.5 v35.15,21.55 | v41.7,18.65 v41.7,22.85 | v57.5,18.55 v57.5,21.55 | v64.05,18.6 v64.05,22.8 | v79.75,18.6 v79.75,21.65 | v86.3,18.55 v86.3,22.8 | v102.1,18.55 v102.1,21.55 | v108.55,18.55 v108.55,22.75 | v108.45,31.4 v108.45,28.45 | v101.9,31.4 v101.9,27.15 | v86,31.35 v86,28.5 | v79.5,31.35 v79.5,27.15 | v63.6,31.45 v63.6,28.4 | v57.05,31.35 v57.05,27.2 | v41.4,31.3 v41.4,28.25 | v34.85,31.2 v34.85,27.5 | v19.25,31.2 v19.25,28.4 | v12.7,31.25 v12.7,27.1
  pour Top: 1.35,0 1.35,49.9 119.35,49.9 119.35,0
GNDCC0  (via drill 0.35)
  Top 0.305: 3.3VREG0.1 13.65,15.1 13.65,13.7 13.26,13.31 12.32,13.31 10.46,11.45 v10.3,11.45
  Bottom 0.305: v10.3,11.45 10.3,10.79 INOUT0.1
GNDCC1  (via drill 0.35)
  Top 0.305: 3.3VREG1.1 36.12,13.32 36,13.2 35.91,13.2 35.79,13.31 34.76,13.31 34.03,12.59 34.03,12.58 v32.9,11.45
  Bottom 0.305: v32.9,11.45 32.9,10.63 INOUT1.1
GNDCC2  (via drill 0.35)
  Top 0.305: v55.2,11.4 55.23,11.4 57.15,13.31 58.18,13.31 58.46,13.6 3.3VREG2.1
  Bottom 0.305: v55.2,11.4 56.4,10.21 INOUT2.1
GNDCC3  (via drill 0.35)
  Top 0.305: v77.7,11.65 77.72,11.65 79.39,13.31 80.42,13.31 80.75,13.65 3.3VREG3.1
  Bottom 0.305: v77.7,11.65 78.63,10.71 INOUT3.1
GNDCC4  (via drill 0.35)
  Top 0.305: v99.85,11.6 99.96,11.6 101.68,13.31 102.71,13.31 103.04,13.65 3.3VREG4.1
  Bottom 0.305: v99.85,11.6 100.92,10.53 INOUT4.1
GNDCC5  (via drill 0.35)
  Top 0.305: 3.3VREG5.1 107.5,34.88 107.5,36.17 107.87,36.53 108.9,36.53 109.63,37.26 109.63,37.43 v110.65,38.45
  Bottom 0.305: v110.65,38.45 109.66,39.45 INOUT5.1
GNDCC6  (via drill 0.35)
  Top 0.305: 3.3VREG6.1 85.05,36.13 85.51,36.59 86.54,36.59 88.45,38.5 v88.5,38.5
  Bottom 0.305: v88.5,38.5 87.29,39.7 INOUT6.1
GNDCC7  (via drill 0.35)
  Top 0.305: 3.3VREG7.1 62.64,36.3 62.92,36.59 64.08,36.59 v66.09,38.6 v66.1,38.6
  Bottom 0.305: v66.1,38.6 64.83,39.87 INOUT7.1
GNDCC8  (via drill 0.35)
  Top 0.305: 3.3VREG8.1 40.45,34.86 40.45,36.3 40.69,36.53 41.87,36.53 42.6,37.26 42.6,37.4 v43.65,38.45
  Bottom 0.305: v43.65,38.45 42.62,39.48 INOUT8.1
GNDCC9  (via drill 0.35)
  Top 0.305: 3.3VREG9.1 18.26,36.1 18.74,36.59 19.79,36.59 v21.6,38.4
  Bottom 0.305: v21.6,38.4 21.6,39.23 INOUT9.1
MAINLED
  Top 0.102: MAINLED.A 3.15,17.65 3.55,18.05 5.85,18.05 5.98,18.18 MAINLEDR.2
N$1  (via drill 4)
  other vias: 26.45,30.05
N$2  (via drill 0.35)
  other vias: 14.6,18.4
N$3  (via drill 0.35)
  other vias: 17.45,18.4
N$4  (via drill 0.35)
  other vias: 37,18.3
N$5  (via drill 0.35)
  other vias: 39.8,18.25
N$6  (via drill 0.35)
  other vias: 59.35,18.3
N$7  (via drill 0.35)
  other vias: 62.15,18.25
N$8  (via drill 0.35)
  other vias: 81.65,18.25
N$9  (via drill 0.35)
  other vias: 84.5,18.2
N$10  (via drill 0.35)
  other vias: 103.9,18.25
N$11  (via drill 0.35)
  other vias: 106.75,18.2
N$12  (via drill 0.35)
  other vias: 106.6,31.6
N$13  (via drill 0.35)
  other vias: 103.75,31.6
N$14  (via drill 0.35)
  other vias: 84.2,31.6
N$15  (via drill 0.35)
  other vias: 81.35,31.6
N$16  (via drill 0.35)
  other vias: 61.75,31.6
N$17  (via drill 0.35)
  other vias: 58.95,31.6
N$18  (via drill 0.35)
  other vias: 39.55,31.6
N$19  (via drill 0.35)
  other vias: 36.75,31.6
N$20  (via drill 0.35)
  other vias: 17.4,31.55
N$21  (via drill 0.35)
  other vias: 14.55,31.55
N$22  (via drill 4)
  other vias: 26.4,21
SC0
  Top 0.102: INOUT0.7 19.24,9.53 20.45,8.32 SC0HVR.2 25.15,8.32 25.25,8.42 25.25,8.85 25.42,9.02 26.47,9.02 26.75,9.3 26.75,11.51 SC0LVT.3
SC1
  Top 0.102: SC1LVT.3 48.95,11.52 48.95,9.37 48.75,9.17 48.08,9.17 47.65,8.75 47.65,8.65 47.45,8.45 47.03,8.45 SC1HVR.2 46.93,8.55 42.6,8.55 INOUT1.7
SC2
  Top 0.102: SC2LVT.3 71.53,9.25 71.36,9.09 70.28,9.09 70.1,8.9 70.1,8.55 69.92,8.37 SC2HVR.2 65.17,8.37 INOUT2.7
SC3
  Top 0.102: SC3LVT.3 93.77,9.25 93.5,8.98 93.5,8.97 92.57,8.97 92.35,8.75 92.35,8.4 92.2,8.25 91.66,8.25 SC3HVR.2 87.52,8.27 INOUT3.7
SC4
  Top 0.102: SC4LVT.3 116.1,11.57 116.1,9.57 115.9,9.37 114.77,9.37 114.6,9.2 114.6,8.8 114.47,8.67 SC4HVR.2 113.12,9.53 INOUT4.7
SC5
  Top 0.102: SC5LVT.3 94.65,38.26 94.65,40.4 94.92,40.67 95.75,40.67 95.9,40.82 95.9,41.2 96,41.3 96.55,41.3 SC5HVR.2 97.67,40.32 INOUT5.7
SC6
  Top 0.102: SC6LVT.3 72.35,38.15 72.35,40.4 72.62,40.67 73.24,40.67 73.63,41.05 73.65,41.05 73.65,41.25 73.77,41.37 SC6HVR.2 75.31,40.37 INOUT6.7
SC7
  Top 0.102: 51.84,41.44 SC7HVR.2 | SC7LVT.3 49.85,38.26 49.85,40.55 50.07,40.77 50.73,40.77 50.77,40.8 50.95,40.8 51.17,41.02 51.17,41.3 51.44,41.57 SC7HVR.2 | INOUT7.7 56.12,41.47 SC7HVR.2
SC8
  Top 0.102: SC8LVT.3 27.6,38.17 27.6,40.5 27.92,40.82 28.72,40.82 29.02,41.12 29.02,41.4 29.14,41.52 SC8HVR.2 29.7,41.52 30.9,40.32 INOUT8.7
SC9
  Top 0.102: SC9LVT.3 5.4,40.2 5.7,40.5 6.45,40.5 6.75,40.8 6.75,41.05 6.92,41.22 SC9HVR.2 8.28,40.37 INOUT9.7
SCHV0
  Top 0.102: SC0HVR.1 25.8,8.32 25.8,8.3 25.6,8.1 25.6,7.7 25.75,7.55 26.35,7.55 26.55,7.35 26.55,5.84 SC0HVT.3
SCHV1
  Top 0.102: SC1HVR.1 48.69,8.45 48.05,8.45 48.05,7.75 48.1,7.7 49,7.7 49.07,7.63 SC1HVT.3
SCHV2
  Top 0.102: SC2HVT.3 71.46,6.09 71.45,6.1 71.45,7.35 71.2,7.6 70.65,7.6 70.42,7.83 70.42,8.2 70.59,8.37 SC2HVR.1
SCHV3
  Top 0.102: SC3HVT.3 93.8,5.71 93.8,7.55 93.73,7.62 92.8,7.62 92.72,7.7 92.72,8.1 92.89,8.27 SC3HVR.1
SCHV4
  Top 0.102: SC4HVR.1 115.66,8.65 115.2,8.65 115,8.45 115,8.15 115.2,7.95 115.8,7.95 115.99,7.76 SC4HVT.3
SCHV5
  Top 0.102: SC5HVR.1 95.47,41.37 95.6,41.5 95.6,41.85 95.45,42 94.7,42 94.53,42.17 SC5HVT.3
SCHV6
  Top 0.102: SC6HVR.1 72.64,41.4 73.1,41.4 73.3,41.6 73.3,41.95 73.17,42.08 72.35,42.08 72.2,42.23 72.2,44.29 SC6HVT.3
SCHV7
  Top 0.102: SC7HVR.1 50.62,41.47 50.8,41.65 50.8,42 50.6,42.2 49.9,42.2 49.7,42.4 SC7HVT.3
SCHV8
  Top 0.102: SC8HVT.3 27.55,44.22 27.55,42.55 27.8,42.3 28.4,42.3 28.6,42.1 28.6,41.7 28.42,41.52 SC8HVR.1
SCHV9
  Top 0.102: SC9HVT.3 5.33,42.1 5.53,41.9 6.2,41.9 6.4,41.7 6.4,41.4 6.22,41.22 SC9HVR.1
SCL  (via drill 0.35)  (1 unrouted)
  Top 0.102: SC2LVT.2 69.43,10.7 70.65,10.7 70.8,10.85 70.8,11.45 70.6,11.65 | 71.32,14.7 SC2LVR.2 70.9,14.62 70.8,14.52 70.8,11.85 70.6,11.65 | SC3LVT.2 92.9,10.7 93.1,10.9 93.1,11.55 92.9,11.75 | SC5LVR.2 95.4,35.38 95.4,35.41 95.64,35.65 95.64,37.8 95.9,38.06 | SC5LVT.2 95.64,39.11 95.64,38.35 95.89,38.1 95.9,38.1 | SC7LVR.2 50.6,35.38 50.74,35.52 50.74,37.89 51,38.15 | SC8LVR.2 28.15,35.38 28.15,35.41 28.39,35.65 28.39,37.85 28.74,38.2 | SC9LVR.2 6,35.28 6,35.31 6.19,35.5 6.19,37.85 6.49,38.15 6.5,38.15 | SC9LVT.2 6.19,39.08 6.19,38.46 6.5,38.15 | 95.94,38.1 v98.5,38.1 | v76.05,38.1 76.05,38.05 73.55,38.05 | v31.35,38.15 31.35,38.2 28.74,38.2 | SC4LVR.2 115.79,14.55 115.36,14.55 115.21,14.4 115.21,11.86 115,11.65 | SC4LVT.2 115.07,10.66 115.21,10.8 115.21,11.44 115,11.65 | v112.1,11.65 115,11.65 | v89.85,11.75 92.9,11.75 | v67.7,11.65 70.6,11.65 | v45.4,11.65 47.9,11.65 | SC1LVT.2 48.1,10.71 48.1,11.45 47.9,11.65 | SC1LVR.2 48.4,14.59 48.29,14.59 48.16,14.45 48.16,11.91 47.9,11.65 | v22.95,11.65 25.55,11.65 | SC0LVR.2 26.32,14.5 25.81,14.5 25.71,14.4 25.71,11.81 25.55,11.65 | SC0LVT.2 25.52,10.66 25.71,10.85 25.71,11.49 25.55,11.65 | SC3LVR.2 93.22,14.67 93.1,14.55 93.1,11.95 92.9,11.75 | 95.9,38.06 95.94,38.1 | 95.94,38.1 95.9,38.1 | 95.9,38.06 95.9,38.1 | SC6LVR.2 73,35.33 73.22,35.55 73.22,37.75 73.52,38.05 73.22,38.35 73.22,38.85 73.45,39.08 SC6LVT.2 | 51,38.15 50.74,38.41 50.74,38.95 50.92,39.13 SC7LVT.2 | 51,38.15 v53.55,38.15 | 28.74,38.2 28.39,38.55 28.39,38.9 28.57,39.08 SC8LVT.2 | 6.5,38.15 v9.25,38.15
  Bottom 0.102: 23,11.6 v22.95,11.65 22.95,8.35 | v67.7,11.65 67.75,11.6 67.75,8.35 | v9.25,38.15 9.25,41.6 | v31.35,38.15 31.35,41.55 | v53.55,38.15 53.55,41.55 | v98.5,38.1 98.5,41.6 | v76.05,38.1 76.05,41.55 | 45.4,8.35 v45.4,11.65 | 89.85,8.3 v89.85,11.75 | 9.25,41.6 9,41.85 4.3,41.85 3.9,41.45 3.9,28.39 4.97,27.32 4.97,24.28 3.9,23.21 3.9,8.3 4.25,8 22.6,8 22.95,8.35 | 9.25,41.6 9.5,41.85 31.05,41.85 31.35,41.55 | 31.35,41.55 31.65,41.85 53.25,41.85 53.55,41.55 | 53.55,41.55 53.85,41.85 75.75,41.85 76.05,41.55 | 76.05,41.55 76.35,41.85 98.25,41.85 98.5,41.6 | 98.5,41.6 98.75,41.85 116.65,41.85 116.85,41.65 116.85,12 116.55,11.65 v112.1,11.65 112.1,8.4 111.7,8 90.15,8 89.85,8.3 | 89.85,8.3 89.55,8 68.1,8 67.77,8.32 | 67.72,8.32 67.4,8 45.75,8 45.4,8.35 | 67.72,8.32 67.77,8.32 | 67.75,8.35 67.72,8.32 | 67.75,8.35 67.77,8.32 | 45.4,8.35 45.05,8 23.3,8 22.95,8.35
SD0
  Top 0.102: SD0LVT.3 4.81,6.25 4.95,6.11 6.04,6.11 6.15,6 6.15,5.5 6.24,5.41 SD0HVR.2 7.85,6.47 9.24,6.47 9.58,6.81 9.58,8.2 10.42,9.04 10.42,10.55 10.54,10.67 11.44,10.67 INOUT0.2
SD1
  Top 0.102: INOUT1.2 33.88,10.67 32.98,10.67 32.86,10.55 32.86,9.32 32.33,8.79 32.33,6.76 31.99,6.42 30.49,6.42 SD1HVR.2 29.87,5.71 29.44,5.71 29.25,5.9 29.25,6.3 29.04,6.51 27.8,6.51 27.68,6.63 SD1LVT.3
SD2
  Top 0.102: SD2LVT.3 50.05,8.3 50.05,6.65 50.29,6.41 51.1,6.41 51.17,6.35 51.5,6.35 51.5,5.85 51.64,5.71 SD2HVR.2 52.88,6.42 54.39,6.42 54.73,6.76 54.73,10.03 55.37,10.67 56.27,10.67 INOUT2.2
SD3
  Top 0.102: SD3LVT.3 72.6,8.24 72.6,6.75 72.84,6.51 73.49,6.51 73.66,6.35 73.9,6.35 73.9,6 74.09,5.81 SD3HVR.2 75.12,6.37 76.74,6.37 77.49,7.12 77.49,10.55 77.61,10.67 78.51,10.67 INOUT3.2
SD4
  Top 0.102: SD4LVT.3 94.8,6.71 95,6.51 96,6.51 96.2,6.31 96.2,5.8 96.35,5.65 96.84,5.65 SD4HVR.2 97.46,6.42 98.89,6.42 99.23,6.76 99.23,10 99.9,10.67 100.8,10.67 INOUT4.2
SD5
  Top 0.102: INOUT5.2 109.78,39.18 110.68,39.18 111.32,39.82 111.32,42.79 111.66,43.13 112.86,43.13 SD5HVR.2 114.75,44.51 114.9,44.36 114.9,44.05 115.15,43.8 116.08,43.8 116.23,43.65 SD5LVT.3
SD6
  Top 0.102: INOUT6.2 87.42,39.23 88.32,39.23 89.02,39.93 89.02,42.79 89.36,43.13 90.5,43.13 SD6HVR.2 91.84,44.11 92.15,43.8 92.15,43.55 92.3,43.4 93.15,43.4 93.37,43.18 SD6LVT.3
SD7
  Top 0.102: INOUT7.2 64.96,39.23 65.86,39.23 65.98,39.35 65.98,41.19 66.83,42.05 66.57,42.31 66.57,42.79 66.91,43.13 67.39,43.13 67.65,42.87 68.94,44.16 SD7HVR.2 69.45,44.15 69.65,43.95 69.65,43.6 69.8,43.45 71.05,43.45 71.21,43.29 SD7LVT.3
SD8
  Top 0.102: SD8LVT.3 48.8,41.4 48.8,43.1 48.6,43.3 47.7,43.3 47.6,43.4 47.6,43.94 47.5,44.05 47.45,44.1 SD8HVR.2 45.78,43.13 44.71,43.13 44.37,42.79 44.37,39.9 43.65,39.18 42.75,39.18 INOUT8.2
SD9
  Top 0.102: SD9LVT.3 26.56,41.43 26.56,43.1 26.55,43.1 26.35,43.3 25.35,43.3 25.2,43.45 25.2,43.75 24.94,44.01 SD9HVR.2 23.67,43.13 22.56,43.13 22.22,42.79 22.22,39.96 21.49,39.23 20.59,39.23 INOUT9.2
SDA  (via drill 0.35)
  Top 0.102: v67.15,42.55 67.15,39.15 67.45,38.85 68.95,38.85 69.15,39.05 | 74.61,9.3 SD3LVT.2 74.61,10.65 | SD4LVR.2 96.76,11.6 96.3,11.6 96.15,11.45 96.15,11 96.25,10.9 96.8,10.9 97,10.7 | SD4LVT.2 97,9.53 97,10.7 | SD2LVR.2 52.23,11.55 51.85,11.55 51.85,11.5 51.65,11.3 51.65,11.05 51.75,10.95 51.82,10.95 52.12,10.65 | SD2LVT.2 52.12,10.65 | SD1LVR.2 29.84,11.45 29.3,11.45 29.2,11.35 29.2,10.95 29.35,10.8 29.6,10.8 29.78,10.62 | v31.75,7 31.75,10.55 31.5,10.8 29.96,10.8 29.78,10.62 | SD1LVT.2 29.78,10.62 | SD0LVR.2 6.3,11.1 6.15,10.95 6.15,10.6 6.3,10.45 6.76,10.45 6.91,10.3 | v9,7.05 9,10.3 8.85,10.45 7.06,10.45 6.91,10.3 | SD0LVT.2 6.91,10.3 | 114.13,39.55 SD5LVT.2 | SD6LVR.2 91.59,38.2 92.05,38.2 92.15,38.3 92.15,38.65 92.05,38.75 91.4,38.75 91.27,38.88 | 91.27,38.88 SD6LVT.2 | SD7LVR.2 69.03,38.15 69.5,38.15 69.65,38.3 69.65,38.7 69.45,38.9 69.3,38.9 69.15,39.05 | SD7LVT.2 69.15,40.46 69.15,39.05 | SD8LVR.2 46.82,38.2 47.3,38.2 47.45,38.35 47.45,38.7 47.35,38.8 46.85,38.8 46.65,39 | 46.65,39 SD8LVT.2 | v44.95,42.55 44.95,39.05 45.2,38.8 46.45,38.8 46.65,39 | SD9LVR.2 24.6,38.1 25.05,38.1 25.25,38.3 25.25,38.65 25.1,38.8 24.7,38.8 24.54,38.96 | SD9LVT.2 24.54,38.96 | v22.8,42.55 22.8,39.05 23.05,38.8 24.4,38.8 24.54,38.94 24.54,38.96 | SD3LVR.2 73.85,11.55 73.85,10.9 73.95,10.84 74.45,10.84 74.61,10.68 | v76.5,6.95 76.49,10.84 74.8,10.84 74.64,10.68 | 52.12,10.65 52.42,10.95 53.8,10.95 54.15,10.6 v54.15,7 | 74.61,10.65 74.64,10.68 | 74.61,10.68 74.61,10.65 | 74.64,10.68 74.61,10.68 | 97,10.7 97.2,10.9 98.45,10.9 98.65,10.7 v98.65,7 | SD5LVR.2 114.77,38.52 114.95,38.7 114.95,39.1 114.85,39.2 114.5,39.2 114.15,39.55 114.13,39.55
  Top 0.102: 114.13,39.55 113.8,39.22 112.15,39.22 111.9,39.47 v111.9,42.55 | 91.27,38.88 91.27,38.87 91.15,38.75 89.75,38.75 89.6,38.9 v89.6,42.55
  Bottom 0.102: 111.85,42.55 111.9,42.5 117.1,42.5 117.5,42.1 117.5,7.35 117.15,7 v98.65,7 98.6,6.95 v76.5,6.95 54.2,6.95 v54.15,7 v31.75,7 9.05,7 v9,7.05 3.1,7.05 2.65,7.5 2.65,24.16 2.53,24.28 2.53,27.32 2.65,27.44 2.65,42 3.2,42.55 v22.8,42.55 v44.95,42.55 v67.15,42.55 v89.6,42.55 v111.9,42.55
SDHV0
  Top 0.102: SD0HVT.3 4.82,4.62 4.9,4.7 5.6,4.7 5.75,4.85 5.75,5.2 5.54,5.41 SD0HVR.1
SDHV1
  Top 0.102: SD1HVR.1 28.65,5.8 28.85,5.6 28.85,5.15 28.7,5 27.74,5 27.54,4.8 SD1HVT.3
SDHV2
  Top 0.102: SD2HVR.1 50.58,5.6 50.9,5.6 51.15,5.35 51.15,5.1 51.05,5 50.2,5 49.95,4.75 SD2HVT.3
SDHV3
  Top 0.102: SD3HVT.3 72.14,4.65 72.49,5 73.25,5 73.5,5.25 73.5,5.6 73.29,5.81 SD3HVR.1
SDHV4
  Top 0.102: SD4HVR.1 95.15,5.6 95.6,5.6 95.8,5.4 95.8,5 95.7,4.9 94.8,4.9 94.55,4.65 94.55,2.48 SD4HVT.3
SDHV5
  Top 0.102: SD5HVR.1 115.34,44.51 115.2,44.65 115.2,45.15 115.4,45.35 115.95,45.35 116.11,45.51 SD5HVT.3
SDHV6
  Top 0.102: SD6HVT.3 93.75,45.1 93.6,44.95 92.65,44.95 92.5,44.8 92.5,44.25 92.64,44.11 SD6HVR.1
SDHV7
  Top 0.102: SD7HVR.1 70.53,44.3 70.15,44.3 70,44.45 70,44.85 70.2,45.05 71.1,45.05 71.3,45.25 SD7HVT.3
SDHV8
  Top 0.102: SD8HVT.3 49.05,47.47 49.05,45.1 48.8,44.85 47.9,44.85 47.75,44.7 47.75,44.35 47.95,44.15 48.42,44.15 SD8HVR.1
SDHV9
  Top 0.102: SD9HVT.3 26.9,47.48 26.9,45.25 26.65,45 25.8,45 25.6,44.8 25.6,44.4 25.99,44.01 SD9HVR.1

## Text on the board
silktop: 5V / Act | 3.3V / Act | 5V / Act | 3.3V / Act | 5V / Act | 3.3V / Act | 5V / Act | 3.3V / Act | 5V / Act | 3.3V / Act | 3.3V / Act | 5V / Act | 3.3V / Act | 5V / Act | 3.3V / Act | 5V / Act | 3.3V / Act | 5V / Act | 3.3V / Act | 5V / Act | Created By / Lynton Brown / 11/29/2017 | ON
silkbottom: I2C Logic Level Hub